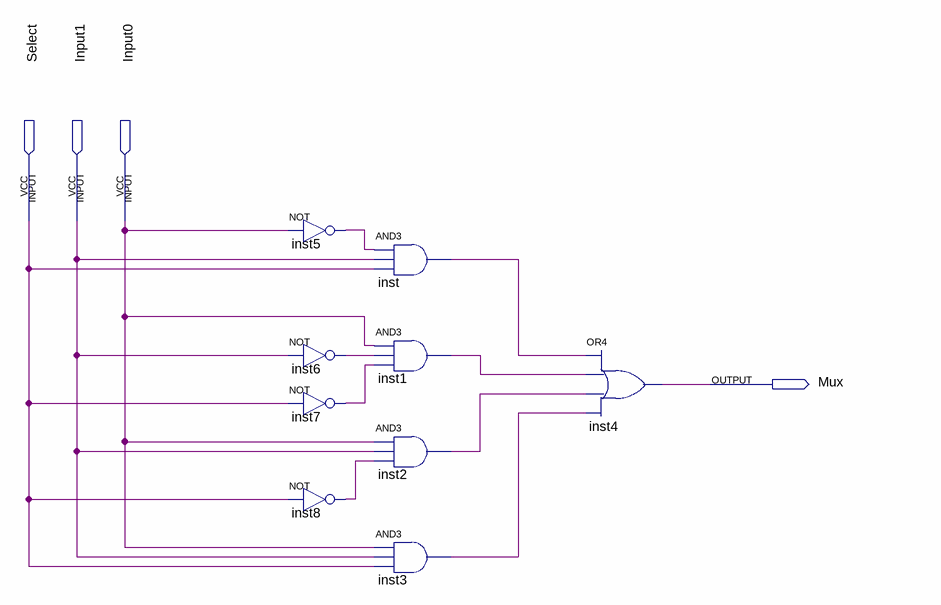
[diagram p0: schematic sheet]
// Quartus schematic MUX_Gates.bdf as structural Verilog: 9 symbols, 4 pins
module MUX_Gates (
  input  Select,
  input  Input1,
  input  Input0,
  output Mux
);

  wire inst1_out, inst2_out, inst3_out, inst5_out, inst6_out, inst7_out, inst8_out, inst_out;

  not inst5 (inst5_out, Input0);
  not inst6 (inst6_out, Input1);
  not inst7 (inst7_out, Select);
  not inst8 (inst8_out, Select);
  and inst (inst_out, inst5_out, Input1, Select);
  and inst1 (inst1_out, Input0, inst6_out, inst7_out);
  and inst2 (inst2_out, Input0, Input1, inst8_out);
  and inst3 (inst3_out, Input0, Input1, Select);
  or inst4 (Mux, inst_out, inst1_out, inst2_out, inst3_out);
endmodule
